# EAGLE design HP25E_1 (EAGLE 9.4.0)
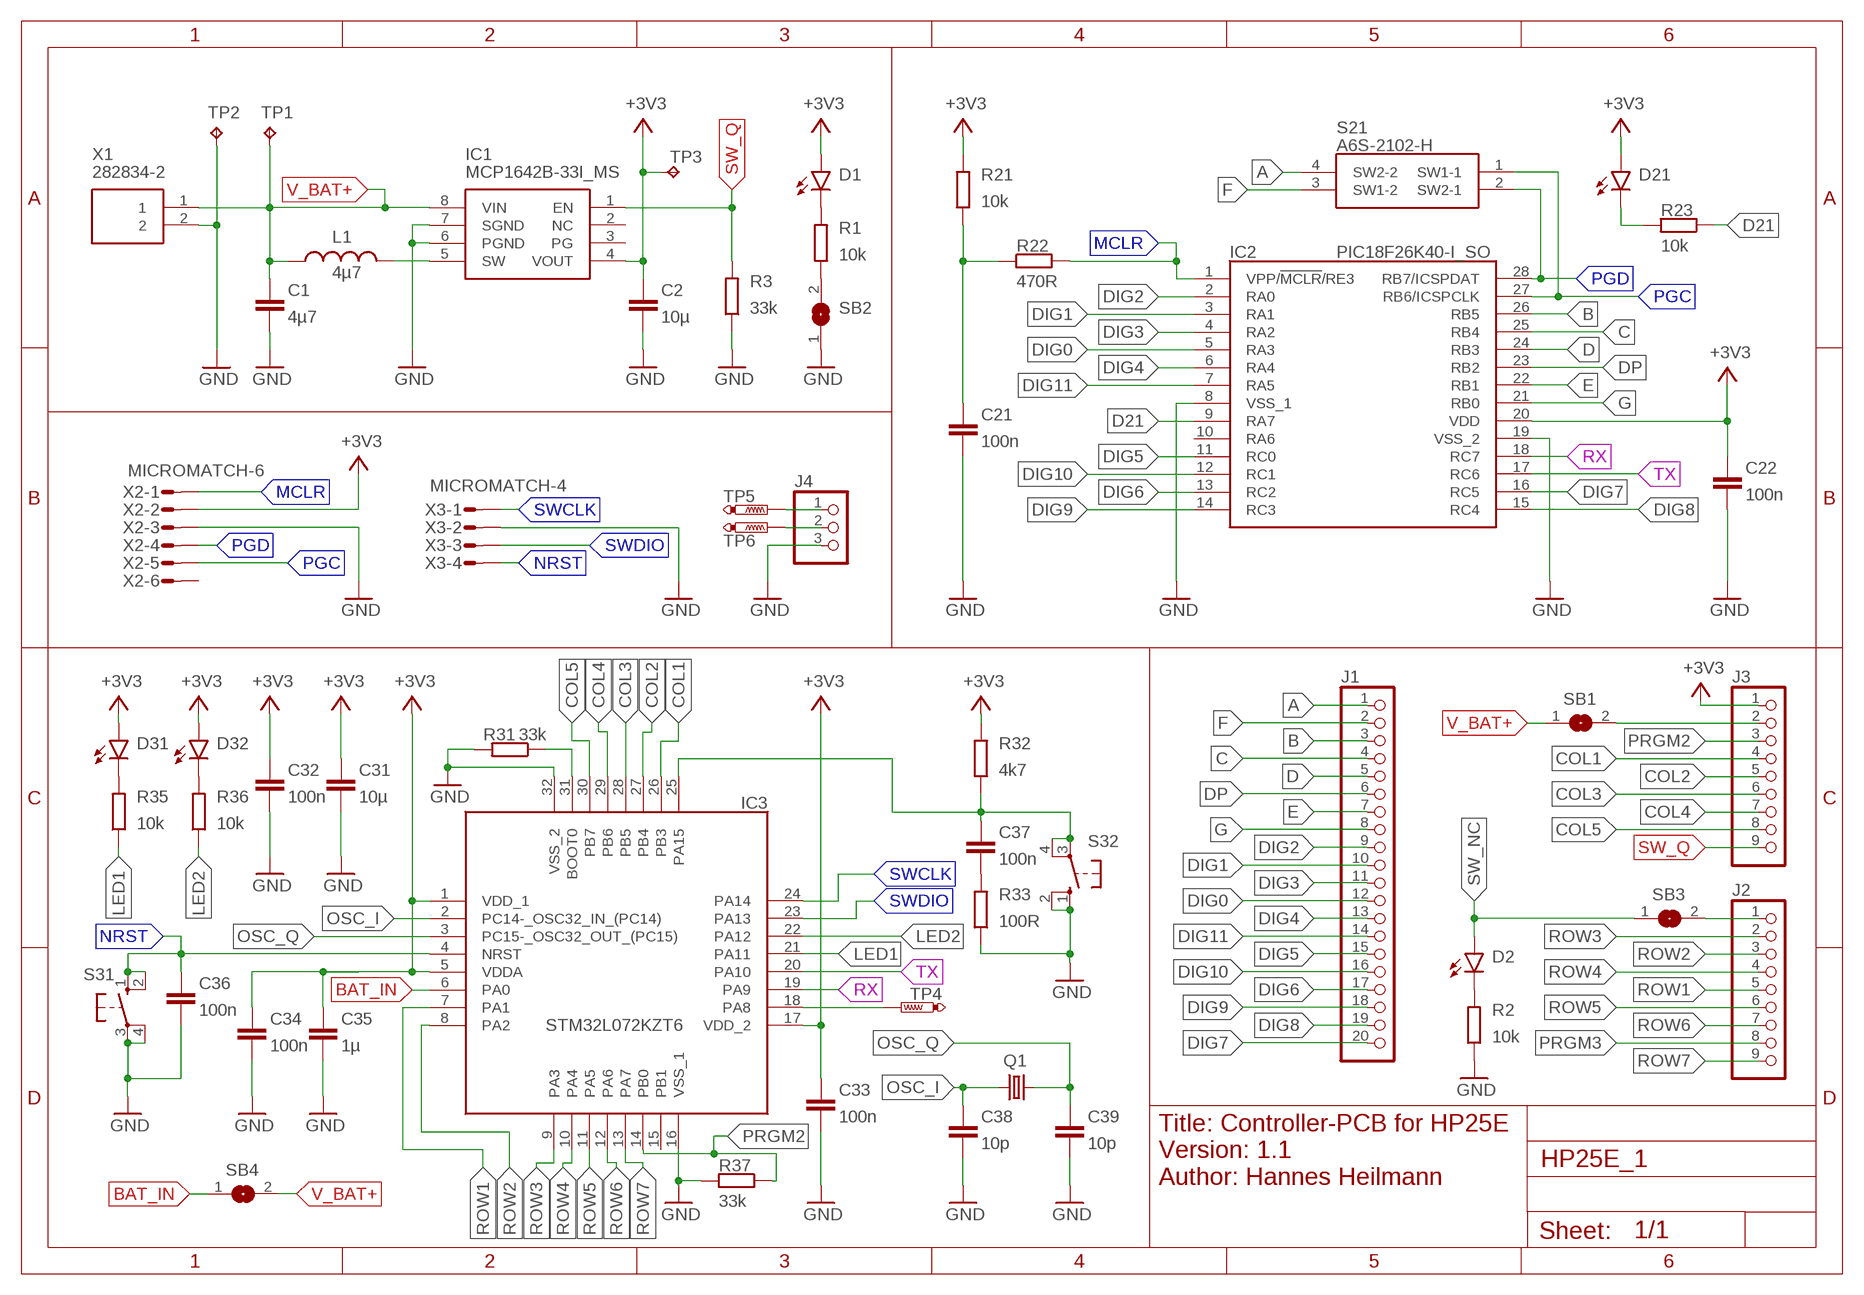
[diagram p0: schematic, sheet 1]

## Parts
C1  4µ7  C-EUC1206K  [C1206K]
C2  10µ  C-EUC1206K  [C1206K]
C21  100n  C-EUC0805K  [C0805K]
C22  100n  C-EUC0805K  [C0805K]
C31  10µ  C-EUC1206K  [C1206K]
C32  100n  C-EUC0805K  [C0805K]
C33  100n  C-EUC0805K  [C0805K]
C34  100n  C-EUC0805K  [C0805K]
C35  1µ  C-EUC1206K  [C1206K]
C36  100n  C-EUC0805K  [C0805K]
C37  100n  C-EUC0805K  [C0805K]
C38  10p  C-EUC0805K  [C0805K]
C39  10p  C-EUC0805K  [C0805K]
D1  LEDSML0805  [SML0805]
D2  LEDSML0805  [SML0805]
D21  LEDSML0805  [SML0805]
D31  LEDSML0805  [SML0805]
D32  LEDSML0805  [SML0805]
IC1  MCP1642B-33I_MS  [SOP65P490X110-8N]
IC2  PIC18F26K40-I_SO  [SOIC127P1030X265-28N]
IC3  STM32L072KZT6  [QFP80P900X900X160-32N]
J1  PINHD-1X20-BIG  [1X20-BIG]
J2  PINHD-1X9  [1X09-BIG]
J3  PINHD-1X9  [1X09-BIG]
J4  PINHD-1X3  [1X03]
L1  4µ7  L-USL4532P  [L4532P]
Q1  CRYSTALMM20SS  [MM20SS]
R1  10k  R-EU_R0805  [R0805]
R2  10k  R-EU_R0805  [R0805]
R3  33k  R-EU_R0805  [R0805]
R21  10k  R-EU_R0805  [R0805]
R22  470R  R-EU_R0805  [R0805]
R23  10k  R-EU_R0805  [R0805]
R31  33k  R-EU_R0805  [R0805]
R32  4k7  R-EU_R0805  [R0805]
R33  100R  R-EU_R0805  [R0805]
R35  10k  R-EU_R0805  [R0805]
R36  10k  R-EU_R0805  [R0805]
R37  33k  R-EU_R0805  [R0805]
S21  A6S-2102-H  [SOP254P980X450-4N]
S31  10-XX  [B3F-10XX]
S32  10-XX  [B3F-10XX]
SB1  SJ  [SJ]
SB2  SJ  [SJ]
SB3  SJ  [SJ]
SB4  SJ  [SJ]
TP1  TPB1,27  [B1,27]
TP2  TPB1,27  [B1,27]
TP3  TPB1,27  [B1,27]
TP4  PTR1B1,27  [B1,27]
TP5  PTR1PAD1-13  [P1-13]
TP6  PTR1PAD1-13  [P1-13]
X1  282834-2  [SHDR2W85P0X254_1X2_554X650X103]
X2  MICROMATCH-6  [MICROMATCH-6]
X3  MICROMATCH-4  [MICROMATCH-4]

## Nets
+3V3: C2.1 C22.1 C31.1 C32.1 C33.1 C34.1 C35.1 D1.A D21.A D31.A D32.A IC1.4(VOUT) IC2.20(VDD) IC3.1(VDD_1) IC3.5(VDDA) IC3.17(VDD_2) J3.1 R21.2 R32.2 TP3.TP X2.2
A: J1.1 S21.4(SW2-2)
B: IC2.26(RB5) J1.3
BAT_IN: IC3.6(PA0) SB4.1
C: IC2.25(RB4) J1.4
COL1: IC3.26(PB3) J3.4
COL2: IC3.27(PB4) J3.5
COL3: IC3.28(PB5) J3.6
COL4: IC3.29(PB6) J3.7
COL5: IC3.30(PB7) J3.8
D: IC2.24(RB3) J1.5
D21: IC2.9(RA7) R23.1
DIG0: IC2.5(RA3) J1.12
DIG1: IC2.3(RA1) J1.10
DIG2: IC2.2(RA0) J1.9
DIG3: IC2.4(RA2) J1.11
DIG4: IC2.6(RA4) J1.13
DIG5: IC2.11(RC0) J1.15
DIG6: IC2.13(RC2) J1.17
DIG7: IC2.16(RC5) J1.20
DIG8: IC2.15(RC4) J1.19
DIG9: IC2.14(RC3) J1.18
DIG10: IC2.12(RC1) J1.16
DIG11: IC2.7(RA5) J1.14
DP: IC2.23(RB2) J1.6
E: IC2.22(RB1) J1.7
F: J1.2 S21.3(SW1-2)
G: IC2.21(RB0) J1.8
GND: C1.2 C2.2 C21.2 C22.2 C31.2 C32.2 C33.2 C34.2 C35.2 C36.2 C38.2 C39.2 IC1.6(PGND) IC1.7(SGND) IC2.8(VSS_1) IC2.19(VSS_2) IC3.16(VSS_1) IC3.32(VSS_2) J4.3 R2.1 R3.1 R31.2 R33.1 R37.2 S31.3(P) S31.4(P1) S32.1(S) S32.2(S1) SB2.1 TP2.TP X1.2 X2.3 X3.2
LED1: IC3.21(PA11) R35.1
LED2: IC3.22(PA12) R36.1
MCLR: IC2.1(VPP/!MCLR!/RE3) R22.2 X2.1
N$1: IC1.5(SW) L1.1
N$2: D21.C R23.2
N$4: C21.1 R21.1 R22.1
N$5: D1.C R1.2
N$6: D2.C R2.2
N$7: C37.1 IC3.25(PA15) R32.1 S32.3(P) S32.4(P1)
N$8: C37.2 R33.2
N$9: J2.1 SB3.2
N$10: IC3.31(BOOT0) R31.1
N$11: R1.1 SB2.2
N$12: D32.C R36.2
N$14: D31.C R35.2
N$15: J4.2 TP6.TP
N$16: J4.1 TP5.TP
N$17: IC3.18(PA8) TP4.TP
NRST: C36.1 IC3.4(NRST) S31.1(S) S31.2(S1) X3.4
OSC_I: C38.1 IC3.2(PC14-_OSC32_IN_(PC14)) Q1.1
OSC_Q: C39.1 IC3.3(PC15-_OSC32_OUT_(PC15)) Q1.4
PGC: IC2.27(RB6/ICSPCLK) S21.1(SW1-1) X2.5
PGD: IC2.28(RB7/ICSPDAT) S21.2(SW2-1) X2.4
PRGM2: IC3.14(PB0) J3.3 R37.1
PRGM3: J2.8
ROW1: IC3.7(PA1) J2.5
ROW2: IC3.8(PA2) J2.3
ROW3: IC3.9(PA3) J2.2
ROW4: IC3.10(PA4) J2.4
ROW5: IC3.11(PA5) J2.6
ROW6: IC3.12(PA6) J2.7
ROW7: IC3.13(PA7) J2.9
RX: IC2.18(RC7) IC3.19(PA9)
SW_I: J3.2 SB1.2
SW_NC: D2.A SB3.1
SW_Q: IC1.1(EN) J3.9 R3.2
SWCLK: IC3.24(PA14) X3.1
SWDIO: IC3.23(PA13) X3.3
TX: IC2.17(RC6) IC3.20(PA10)
V_BAT+: C1.1 IC1.8(VIN) L1.2 SB1.1 SB4.2 TP1.TP X1.1
Unconnected: IC1.2(NC) IC1.3(PG) IC2.10(RA6) IC3.15(PB1) X2.6

## Notes on the sheet
- Title: Controller-PCB for HP25E
  Version: 1.1
  Author: Hannes Heilmann

## Library data of the parts
C1 C2 C21 C22 C31-C39 = rcl:C-EU: CAPACITOR, European symbol; SPICEPREFIX: C
D1 D2 D21 D31 D32 = led:LED: LED OSRAM: - CHIPLED LG R971, LG N971, LY N971, LG Q971, LY Q971, LO R971, LY R971 LH N974, LH R974 LS Q976, LO Q976, LY Q976 LO Q996 - Hyper CHIPLED LW Q18S LB Q993, LB Q99A, LB R99A - SideLED LS A670, LO A670, LY A670, LG A670, LP A670 LB A673, LV A673, LT A673, LW A673 LH A674 LY A675 LS A676, LA A676, LO A676, LY A676, LW A676 LS A679, LY A679, LG A679 - Hyper Micro SIDELED® LS Y876, LA Y876, LO Y876, LY Y876 LT Y87S - SmartLED LW L88C, LW L88S LB L89C, LB L89S, LG L890 LS L89K, LO L89K, LY L89K LS L896, LA L896, LO L896, LY L896 - TOPLED LS T670, LO T670, LY T670, LG T670, LP T670 LSG T670, LSP T670, LSY T670, LOP T670, LYG T670 LG T671, LOG T671, LSG T671 LB T673, LV T673, LT T673, LW T673 LH T674 LS T676, LA T676, LO T676, LY T676, LB T676, LH T676, LSB T676, LW T676 LB T67C, LV T67C, LT T67C, LS T67K, LO T67K, LY T67K, LW E67C LS E67B, LA E67B, LO E67B, LY E67B, LB E67C, LV E67C, LT E67C LW T67C LS T679, LY T679, LG T679 LS T770, LO T770, LY T770, LG T770, LP T770 LB T773, LV T773, LT T773, LW T773 LH T774 LS E675, LA E675, LY E675, LS T675 LS T776, LA T776, LO T776, LY T776, LB T776 LHGB T686 LT T68C, LB T68C - Hyper Mini TOPLED® LB M676 - Mini TOPLED Santana® LG M470 LS M47K, LO M47K, LY M47K Source: http://www.osram.convergy.de LUXEON: - LUMILED® LXK2-PW12-R00, LXK2-PW12-S00, LXK2-PW14-U00, LXK2-PW14-V00 LXK2-PM12-R00, LXK2-PM12-S00, LXK2-PM14-U00 LXK2-PE12-Q00, LXK2-PE12-R00, LXK2-PE12-S00, LXK2-PE14-T00, LXK2-PE14-U00 LXK2-PB12-K00, LXK2-PB12-L00, LXK2-PB12-M00, LXK2-PB14-N00, LXK2-PB14-P00, LXK2-PB14-Q00 LXK2-PR12-L00, LXK2-PR12-M00, LXK2-PR14-Q00, LXK2-PR14-R00 LXK2-PD12-Q00, LXK2-PD12-R00, LXK2-PD12-S00 LXK2-PH12-R00, LXK2-PH12-S00 LXK2-PL12-P00, LXK2-PL12-Q00, LXK2-PL12-R00 Source: www.luxeon.com KINGBRIGHT: KA-3528ASYC Source: www.kingbright.com
IC1 = SamacSys_Parts:MCP1642B-33I_MS: Conv DC-DC 0.5V to 5.5V Synchronous Step Up Single-Out 3.3V 0.3A 8-Pin MSOP Tube Source: Datasheet <https://ww1.microchip.com/downloads/en/DeviceDoc/20005253A.pdf>; ARROW_PART_NUMBER: MCP1642B-33I/MS; ARROW_PRICE-STOCK: https://www.arrow.com/en/products/mcp1642b-33ims/microchip-technology?region=nac; DESCRIPTION: Conv DC-DC 0.5V to 5.5V Synchronous Step Up Single-Out 3.3V 0.3A 8-Pin MSOP Tube; HEIGHT: 1.1mm; MANUFACTURER_NAME: Microchip; MANUFACTURER_PART_NUMBER: MCP1642B-33I/MS; MOUSER_PART_NUMBER: 579-MCP1642B-33I/MS; MOUSER_PRICE-STOCK: https://www.mouser.co.uk/ProductDetail/Microchip-Technology/MCP1642B-33I-MS?qs=kUzwwg2uGjUwNcbFIRVB%252Bw%3D%3D
IC2 = SamacSys_Parts:PIC18F26K40-I_SO: 8-bit Microcontrollers - MCU 64KB Flash, 4KB RAM, 256B EEPROM, 10-bit ADC2, 5-bit DAC, Comp, PWM, CCP, CWG, HLT, WWDT, SCAN/CRC, ZCD, PPS, EUSART, SPI/I2C, IDLE/DOZE/PMD Source: Datasheet <https://componentsearchengine.com/Datasheets/1/PIC18F26K40-I_SO.pdf>; DESCRIPTION: 8-bit Microcontrollers - MCU 64KB Flash, 4KB RAM, 256B EEPROM, 10-bit ADC2, 5-bit DAC, Comp, PWM, CCP, CWG, HLT, WWDT, SCAN/CRC, ZCD, PPS, EUSART, SPI/I2C, IDLE/DOZE/PMD; HEIGHT: 2.65mm; MANUFACTURER_NAME: Microchip; MANUFACTURER_PART_NUMBER: PIC18F26K40-I/SO; MOUSER_PART_NUMBER: 579-PIC18F26K40-I/SO; MOUSER_PRICE-STOCK: https://www.mouser.com/Search/Refine.aspx?Keyword=579-PIC18F26K40-I%2FSO; RS_PART_NUMBER: 1772185; RS_PRICE-STOCK: http://uk.rs-online.com/web/p/products/1772185
IC3 = SamacSys_Parts:STM32L072KZT6: ARM Microcontrollers - MCU Ultra-low-power ARM Cortex-M0+ MCU with 192-Kbytes Flash, 32 MHz CPU, USB Source: Datasheet <https://www.arrow.com/en/products/stm32l072kzt6/stmicroelectronics>; ARROW_PART_NUMBER: STM32L072KZT6; ARROW_PRICE-STOCK: https://www.arrow.com/en/products/stm32l072kzt6/stmicroelectronics?region=nac; DESCRIPTION: ARM Microcontrollers - MCU Ultra-low-power ARM Cortex-M0+ MCU with 192-Kbytes Flash, 32 MHz CPU, USB; HEIGHT: 1.6mm; MANUFACTURER_NAME: STMicroelectronics; MANUFACTURER_PART_NUMBER: STM32L072KZT6; MOUSER_PART_NUMBER: 511-STM32L072KZT6; MOUSER_PRICE-STOCK: https://www.mouser.co.uk/ProductDetail/STMicroelectronics/STM32L072KZT6?qs=mwoc%252BQmZlGJ4eN3sEity4A%3D%3D
J1 = adafruit:PINHD-1X20: PIN HEADER
J2 J3 = adafruit:PINHD-1X9: Pin header 1x10 0.1" spacing With round pins
J4 = pinhead:PINHD-1X3: PIN HEADER
L1 = rcl:L-US: INDUCTOR, American symbol; SPICEPREFIX: L
Q1 = crystal:CRYSTAL: CRYSTAL; OC_FARNELL: unknown; OC_NEWARK: unknown
R1-R3 R21-R23 R31-R33 R35-R37 = rcl:R-EU_: RESISTOR, European symbol; SPICEPREFIX: R
S21 = SamacSys_Parts:A6S-2102-H: 2 Way Surface Mount DIP Switch DP Source: Datasheet <http://docs-emea.rs-online.com/webdocs/0b76/0900766b80b76b3d.pdf>; DESCRIPTION: 2 Way Surface Mount DIP Switch DP; HEIGHT: 4.5mm; MANUFACTURER_NAME: Omron Electronics; MANUFACTURER_PART_NUMBER: A6S-2102-H; MOUSER_PART_NUMBER: 653-A6S-2102-H; MOUSER_PRICE-STOCK: https://www.mouser.com/Search/Refine.aspx?Keyword=653-A6S-2102-H; RS_PART_NUMBER: 0534768; RS_PRICE-STOCK: http://uk.rs-online.com/web/p/products/0534768
S31 S32 = switch-omron:10-XX: OMRON SWITCH; MPN: B3F-1000; OC_FARNELL: 176432; OC_NEWARK: 36M3542
SB1-SB4 = jumper:SJ: SMD solder JUMPER
TP1-TP3 = testpad:TP: Test pad
TP4-TP6 = testpad:PTR1: TEST PIN
X1 = SamacSys_Parts:282834-2: TE CONNECTIVITY / BUCHANAN - 282834-2 - TERMINAL BLOCK, WIRE TO BRD, 2POS, 16AWG Source: Datasheet <https://www.te.com/commerce/DocumentDelivery/DDEController?Action=srchrtrv&DocNm=282834&DocType=Customer Drawing&DocLang=English&DocFormat=pdf&PartCntxt=282834-2>; ALLIED_NUMBER: 70086732; ALLIED_PRICE-STOCK: https://www.alliedelec.com/te-connectivity-282834-2/70086732/; DESCRIPTION: TE CONNECTIVITY / BUCHANAN - 282834-2 - TERMINAL BLOCK, WIRE TO BRD, 2POS, 16AWG; HEIGHT: 10.3mm; MANUFACTURER_NAME: TE CONNECTIVITY / BUCHANAN; MANUFACTURER_PART_NUMBER: 282834-2
X2 = con-amp-micromatch:MICROMATCH-6: MicroMaTch 6 7-215464-6 / 0-215464-6 Drawing Number C-215464 DDEController.pdf; MPN: 7-215464-6; OC_FARNELL: 3784630; OC_NEWARK: 19R8125
X3 = con-amp-micromatch:MICROMATCH-4: MicroMaTch 4 7-215464-4 / 0-215464-4 Drawing Number C-215464 DDEController.pdf; MPN: 7-215464-4; OC_FARNELL: 3784629; OC_NEWARK: 19R8124

## Board
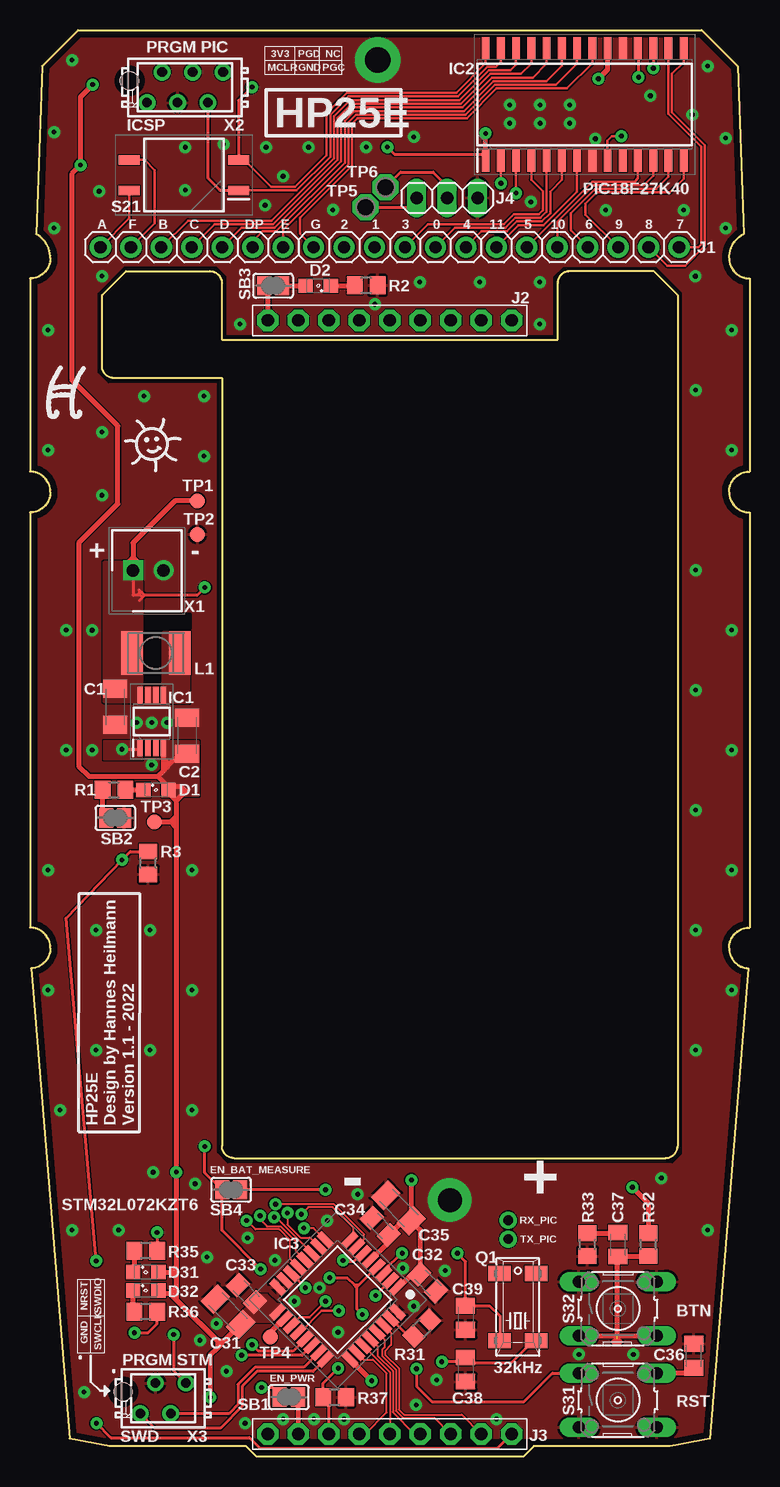
[diagram p1: board, top side]
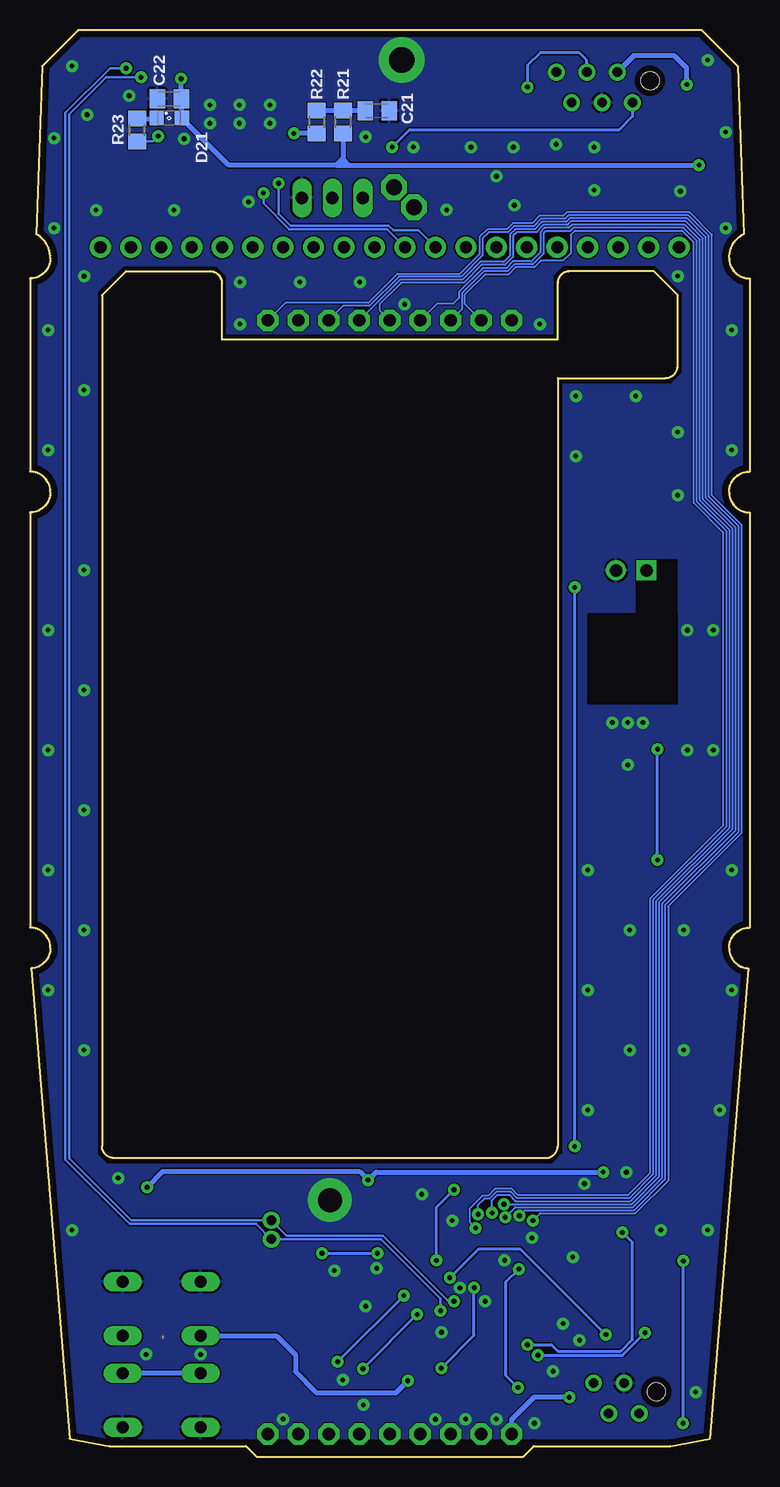
[diagram p2: board, bottom side, seen from below]

Size 60 x 118.88 mm. Coordinates in mm from the lower left corner, seen from the top.
Outline: 1,115.88 4,118.88 56,118.88 59,115.88 59.5,101.88 arc62 58.3,99.88 arc90 60,98.17 60,82.08 arc90 58.3,80.38 arc90 60,78.67 60,44.08 arc90 58.3,42.38 arc87 59.9,40.67 56.7,1.5 53.38,0.88 42,0.88 41.12,0 18.88,0 18,0.88 6.62,0.88 3.3,1.5 0.1,40.67 arc87 1.7,42.38 arc90 0,44.08 0,78.67 arc90 1.7,80.38 arc90 0,82.08 0,98.17 arc90 1.7,99.88 arc62 0.5,101.88 1,115.88
Copper layers (1*16): Top 0.035mm / dielectric 1.5mm / Bottom 0.035mm
Design rules "FVM_default *": minimum track width 0.1mm, minimum drill 0.4mm, track to track 0.1mm, track to pad 0.1mm, pad to pad 0.1mm, via to via 0.1mm, smd to smd 0.1mm, copper to edge 0.5mm, drill to drill 0.2mm, minimum pad ring 0.3mm, minimum via ring 0.3mm, stop-mask expansion 0.075mm, vias tented up to drill 0mil, thermal gap 0.2mm
tRestrict: area 5.7,24.5 to 54.3,99.1; area 9.7,64.3 to 13.4,70.2; area 21.5,4.1 to 21.7,5.8; area 20.1,96.7 to 20.4,98.5; area 16.6,21.3 to 16.9,23.1; area 7,52.3 to 7.2,54.1
bRestrict: area 5.7,24.5 to 54.3,99.1; area 6.1,62.8 to 13.4,70.2; area 6.1,70.3 to 9.4,74.7
Milling: 17 lines

### Footprints (pad centres in the part's own frame; a part is rotated, then mirrored left to right if it is on the bottom)
C1206K = smd 1.5 x 2: 1 -1.5,0; 2 1.5,0
C0805K = smd 1.3 x 1.6: 1 -1,0; 2 1,0
SML0805 = smd 1.2 x 1.2: A 1.05,0; C -1.05,0
SOP65P490X110-8N = smd 1.4 x 0.45: 1 -2.2,0.975; 2 -2.2,0.325; 3 -2.2,-0.325; 4 -2.2,-0.975; 5 2.2,-0.975; 6 2.2,-0.325; 7 2.2,0.325; 8 2.2,0.975
SOIC127P1030X265-28N = smd 1.85 x 0.65: 1 -4.675,8.255; 2 -4.675,6.985; 3 -4.675,5.715; 4 -4.675,4.445; 5 -4.675,3.175; 6 -4.675,1.905; 7 -4.675,0.635; 8 -4.675,-0.635; 9 -4.675,-1.905; 10 -4.675,-3.175; 11 -4.675,-4.445; 12 -4.675,-5.715; 13 -4.675,-6.985; 14 -4.675,-8.255; 15 4.675,-8.255; 16 4.675,-6.985; 17 4.675,-5.715; 18 4.675,-4.445; 19 4.675,-3.175; 20 4.675,-1.905; 21 4.675,-0.635; 22 4.675,0.635; 23 4.675,1.905; 24 4.675,3.175; 25 4.675,4.445; 26 4.675,5.715; 27 4.675,6.985; 28 4.675,8.255
QFP80P900X900X160-32N = smd 1.475 x 0.6: 1 -4.238,2.8; 2 -4.238,2; 3 -4.238,1.2; 4 -4.238,0.4; 5 -4.238,-0.4; 6 -4.238,-1.2; 7 -4.238,-2; 8 -4.238,-2.8; 17 4.238,-2.8; 18 4.238,-2; 19 4.238,-1.2; 20 4.238,-0.4; 21 4.238,0.4; 22 4.238,1.2; 23 4.238,2; 24 4.238,2.8 | smd 0.6 x 1.475: 9 -2.8,-4.238; 10 -2,-4.238; 11 -1.2,-4.238; 12 -0.4,-4.238; 13 0.4,-4.238; 14 1.2,-4.238; 15 2,-4.238; 16 2.8,-4.238; 25 2.8,4.238; 26 2,4.238; 27 1.2,4.238; 28 0.4,4.238; 29 -0.4,4.238; 30 -1.2,4.238; 31 -2,4.238; 32 -2.8,4.238
1X20-BIG = drill 1.016 pad 1.778: 1 -24.13,0; 2 -21.59,0; 3 -19.05,0; 4 -16.51,0; 5 -13.97,0; 6 -11.43,0; 7 -8.89,0; 8 -6.35,0; 9 -3.81,0; 10 -1.27,0; 11 1.27,0; 12 3.81,0; 13 6.35,0; 14 8.89,0; 15 11.43,0; 16 13.97,0; 17 16.51,0; 18 19.05,0; 19 21.59,0; 20 24.13,0
1X09-BIG = drill 1.016 pad 1.778 octagon: 1 -10.16,0; 2 -7.62,0; 3 -5.08,0; 4 -2.54,0; 5 0,0; 6 2.54,0; 7 5.08,0; 8 7.62,0; 9 10.16,0
1X03 = drill 1.016 long: 1 -2.54,0; 2 0,0; 3 2.54,0
L4532P = smd 1.8 x 3.6: 1 -2,0; 2 2,0
MM20SS = smd 1.27 x 1.88: 1 -2.794,-1.524; 2 2.794,-1.524; 3 2.794,1.524; 4 -2.794,1.524
R0805 = smd 1.3 x 1.5: 1 -0.95,0; 2 0.95,0
SOP254P980X450-4N = smd 1.75 x 0.8: 1 -4.55,1.27; 2 -4.55,-1.27; 3 4.55,-1.27; 4 4.55,1.27
B3F-10XX = drill 1.016 long: 1 -3.251,2.261; 2 3.251,2.261; 3 -3.251,-2.261; 4 3.251,-2.261
SJ = smd 1.168 x 1.6: 1 -0.762,0; 2 0.762,0
B1,27 = smd 1.27 x 1.27: TP 0,0
P1-13 = drill 1.321 pad 2.159 octagon: TP 0,0
SHDR2W85P0X254_1X2_554X650X103 = drill 1.05 pad 1.575 square: 1 0,0 | drill 1.05 pad 1.575: 2 2.54,0
MICROMATCH-6 = drill 0.813: 1 3.175,1.27; 2 1.905,-1.27; 3 0.635,1.27; 4 -0.635,-1.27; 5 -1.905,1.27; 6 -3.175,-1.27 | hole 1.5: 4.63,-0.55
MICROMATCH-4 = drill 0.8: 1 1.905,1.27; 2 0.635,-1.27; 3 -0.635,1.27; 4 -1.905,-1.27 | hole 1.5: 3.34,-0.55

### Placement (x,y rotation side)
C1  7.09,62.46 270 top
C2  13.11,60.07 90 top
C21  31.04,112.14 0 bottom
C22  48.39,113.13 180 bottom
C31  16.51,12.07 135 top
C32  33.17,14.48 315 top
C33  18.03,13.59 135 top
C34  29.21,19.18 135 top
C35  30.73,20.7 135 top
C36  55.35,8.4 90 top
C37  49.02,17.66 90 top
C38  36.32,7.24 270 top
C39  36.32,11.56 270 top
D1  10.52,55.55 0 top
D2  24.03,97.56 180 top
D21  48.39,111.53 0 bottom
D31  9.65,15.37 0 top
D32  9.65,13.85 0 top
IC1  10.16,61.24 90 top
IC2  46.25,112.68 90 top
IC3  25.65,13.08 225 top
J1  30,100.78 0 top
J2  30,94.67 0 top
J3  30,1.88 0 top
J4  34.79,104.88 0 top
L1  10.52,66.96 180 top
Q1  40.69,12.45 90 top
R1  7.01,55.55 0 top
R2  28.04,97.59 180 top
R3  9.86,49.46 90 top
R21  33.91,111.2 270 bottom
R22  36.09,111.2 270 bottom
R23  51.05,110.54 90 bottom
R31  32.66,10.7 45 top
R32  51.56,17.66 90 top
R33  46.48,17.66 90 top
R35  9.65,17.15 180 top
R36  9.65,12.07 180 top
R37  25.4,4.96 0 top
S21  12.83,106.78 180 top
S31  49.02,4.69 0 top
S32  49.02,12.31 0 top
SB1  21.59,4.96 0 top
SB2  7.11,53.22 180 top
SB3  20.27,97.56 180 top
SB4  16.76,22.23 180 top
TP1  13.97,79.63 0 top
TP2  13.97,76.84 0 top
TP3  10.39,52.88 0 top
TP4  20.04,9.96 0 top
TP5  27.99,104.12 0 top
TP6  29.64,105.77 0 top
X1  8.59,73.85 0 top
X2  12.93,114.1 180 top
X3  11.1,4.85 180 top

### Tracks (layer width: path | path; a pad name or v marks a point on that pad's centre or on a via)
+3V3  (via drill 0.4)
  Top 0.254: C31.1 18.03,11.47 18.03,11.48
  Top 0.406: IC2.20 48.16,115.57 v47.4,114.81 | C2.1 12.55,58.57 11.44,57.47 | 11.13,57.15 11.44,57.47 | 10.64,56.67 11.13,57.15 | 10.64,56.67 4.93,56.67 4.08,57.52 4.08,76.14 7.32,79.38 7.32,85.88 3.48,89.72 3.48,106.89 v4.22,107.62 4.22,113.31 v5.23,114.33 | 11.13,57.15 11.13,57.79 | 11.13,58.14 11.13,59.03 IC1.4 | 11.44,57.47 11.13,57.79 | 11.13,57.79 11.13,58.14 | 11.44,57.47 11.44,57.83 11.13,58.14 | 10.64,56.67 11.48,55.83 | 11.48,55.83 11.62,55.69 11.62,55.27 12.21,54.69 | 12.21,54.69 12.22,54.69 12.98,55.45 12.6,55.83 11.48,55.83 | 12.21,54.69 12.21,53.32 | 12.21,53.32 12.21,52.45 | 12.21,52.45 v12.21,23.7 12.21,15.83 | 12.21,15.83 12.21,14.91 | 12.21,14.91 12.21,14.12 | 12.21,14.12 12.21,13.07 | IC3.5 29.92,17.91 C34.1 31.09,19.64 C35.1 | IC3.1 30.76,14.1 31.84,15.19 C32.1 32.56,15.29 32.56,18.87 C35.1 | 15.65,9.08 15.03,8.47 v15.03,4.94 v15.04,4.93 | 15.65,9.08 15.92,9.36 | 15.92,9.36 16.19,9.63 | 16.19,9.63 C31.1 | 15.92,9.36 15.65,9.63 | 12.57,12.7 15.65,9.63 | 12.57,12.7 | 12.21,13.07 11.99,13.29 | 11.99,13.29 11.67,13.6 | 15.65,9.63 16.19,9.63 | 15.65,9.63 15.65,9.08 | 12.57,12.7 12.21,13.07 | 11.75,15.37 12.21,14.91 | 11.75,15.37 12.21,15.83 | 11.67,13.6 11.85,13.78 | 11.85,13.78 12.19,14.12 12.21,14.12 | 11.99,13.29 11.99,13.64 11.85,13.78 | C35.1 v31.8,23.03 v31.8,23.04 | v50.24,22.43 51.56,21.11 R32.2 | D31.A 11.75,15.37 | D32.A 10.94,13.6 11.67,13.6 | TP3.TP 11.77,52.88 | 12.21,52.45 11.77,52.88 | 12.21,53.32 11.77,52.88
  Bottom 0.406: R21.2 33.91,108.18 | 33.91,108.18 34.2,107.89 | 34.2,107.89 34.47,107.62 | 34.47,107.62 33.43,107.62 | 33.43,107.62 v4.22,107.62 | 33.43,107.62 33.69,107.89 | 33.69,107.89 33.91,108.1 33.91,108.18 | 33.69,107.89 34.2,107.89 | v5.23,114.33 5.23,115.7 6.27,116.74 9.65,116.74 X2.2 | J3.1 19.84,3.07 17.98,4.93 v15.04,4.93 | v12.21,23.7 31.14,23.7 v31.8,23.04 31.83,23.04 32.54,23.75 48.92,23.75 v50.24,22.43 | 34.47,107.62 43.42,107.62 D21.A 47.34,113.08 C22.1 47.39,114.8 v47.4,114.81
  pour Top (no thermals): 11.05,59.62 14.02,59.62 14.02,55.04 11.05,55.04
  pour Top (no thermals): 17.4,11.76 19.18,13.54 19.74,13.54 20.55,12.73 20.95,12.73 20.95,12.04 20.12,11.2 18.49,11.2 17.96,11.2
A
  Top 0.203: S21.4 8.28,103.17 J1.1
B
  Top 0.203: IC2.26 40.54,115.98 40.08,115.52 38.28,115.52 35.8,113.03 26.69,113.03 25.35,111.69 25.35,108.18 20.16,102.99 13.17,102.99 J1.3
BAT_IN  (via drill 0.4)
  Top 0.254: IC3.6 27.68,16.93 26.98,16.23 26.21,16.23 v26.11,16.33 | v24.64,22.23 SB4.1
  Bottom 0.254: v26.11,16.33 26.11,20.75 v24.64,22.23
C
  Top 0.203: IC2.25 41.81,116.08 40.95,115.22 38.41,115.22 35.92,112.73 26.82,112.73 25.65,111.56 25.65,108.06 20.28,102.69 15.41,102.69 J1.4
COL1
  Top 0.152: IC3.26 27.83,8.08 28.6,8.08 29.75,6.93 29.75,3.68 27.94,1.88 J3.4
COL2
  Top 0.152: IC3.27 30,7.04 J3.5
COL3
  Top 0.152: IC3.28 28.98,9.19 28.98,8.41 30.25,7.14 30.25,3.71 32.08,1.88 J3.6
COL4
  Top 0.152: J3.7 33.73,3.23 31.09,3.23 30.5,3.81 30.5,7.25 29.36,8.39 29.36,8.89 29.57,9.1 29.57,9.74 IC3.29
COL5
  Top 0.152: IC3.30 30.12,10.31 30.12,9.3 29.61,8.79 29.61,8.5 30.76,7.35 30.76,3.92 31.19,3.48 36.02,3.48 J3.8
D
  Top 0.203: IC2.24 43.08,116.06 41.94,114.92 38.54,114.92 36.05,112.43 26.94,112.43 25.95,111.44 25.95,107.93 20.41,102.39 17.64,102.39 J1.5
D21  (via drill 0.4)
  Top 0.203: IC2.9 48.16,109.65 48.54,110.03 v49.3,110.03
  Bottom 0.203: v49.3,110.03 49.74,109.59 R23.1
DIG0
  Top 0.203: J1.12 35.42,102.39 39.65,102.39 40.48,103.22 42.57,103.22 43.08,103.73 IC2.5
DIG1  (via drill 0.4)
  Top 0.203: v40.54,105.28 IC2.3
  Bottom 0.203: J1.10 30.22,102.26 38.38,102.26 40.54,104.42 v40.54,105.28
DIG2  (via drill 0.4)
  Top 0.203: v39.27,106.1 IC2.2
  Bottom 0.203: J1.9 27.59,102.18 29.7,102.18 30.09,102.57 38.25,102.57 39.27,103.58 v39.27,106.1
DIG3
  Top 0.203: J1.11 33.19,102.69 39.52,102.69 40.36,103.53 42.45,103.53 42.77,103.86 42.77,105.44 41.81,106.4 IC2.4
DIG4
  Top 0.203: J1.13 37.66,102.08 39.77,102.08 40.61,102.92 42.7,102.92 43.38,103.61 43.38,105.41 44.35,106.38 IC2.6
DIG5
  Top 0.203: J1.15 46.9,106.25 50.42,106.25 50.7,106.53 IC2.11
DIG6
  Top 0.203: J1.17 45.11,102.17 45.11,103.59 47.16,105.64 52.25,105.64 53.24,106.63 IC2.13
DIG7
  Top 0.203: J1.20 55.73,100.78 55.98,101.03 55.98,109.15 53.24,111.89 IC2.16
DIG8
  Top 0.203: J1.19 53.12,99.24 54.63,99.24 56.28,100.89 56.28,109.27 53.54,112.02 53.54,115.22 54.51,116.18 IC2.15
DIG9
  Top 0.203: J1.18 46.33,103.5 46.33,104.38 47.28,105.34 53.36,105.34 54.51,106.48 IC2.14
DIG10
  Top 0.203: J1.16 43.97,102.88 47.03,105.94 51.18,105.94 51.97,106.73 IC2.12
DIG11
  Top 0.203: J1.14 40.73,102.62 42.82,102.62 45.62,105.41 45.62,106.4 | IC2.7 45.62,106.4 | 45.62,106.4
DP
  Top 0.203: IC2.23 44.35,115.9 43.06,114.61 38.66,114.61 36.17,112.12 27.07,112.12 26.26,111.31 26.26,107.81 20.53,102.08 19.38,102.08 18.57,101.27 J1.6
E
  Top 0.203: IC2.22 45.62,116.08 43.85,114.31 38.79,114.31 36.3,111.82 27.19,111.82 26.56,111.19 26.56,107.68 21.11,102.23 J1.7
F
  Top 0.203: J1.2 10.41,102.78 10.41,107.19 9.55,108.05 S21.3
G
  Top 0.203: IC2.21 46.89,116.11 44.79,114 38.91,114 36.43,111.52 27.32,111.52 26.86,111.06 26.86,107.56 22.53,103.22 22.53,101.89 J1.8
GND  (via drill 0.4, 2, 2.1)
  other vias: 28.75,96.01 37.5,97.88 19.61,104.27 19.68,109.09 25.25,103.88 40,112.63 47.14,109.82 56.5,115.88 3.5,116.38 41.78,104.55 48,103.88 55.47,98.35 6,98.38 5.76,105.44 2,102.38 55.22,111.81 34.62,15.5 31.09,15.7 24.79,19.66 20.42,16.36 18.14,18.21 14.75,16.62 15.54,11.08 14.17,9.68 16.38,7.11 17.93,2.77 21.12,3.12 23.67,3.12 26.2,3.1 25.68,10.37 22.05,12.93 24.16,14.05 13.77,22.73 27.33,21.85 32,12.53 32.21,4.29 33.91,6.38 50.32,8.5 45.77,8.5 38.9,3.12 10.28,23.7 7.39,18.87 4.5,5.38 10,33.88 10,43.88 5.5,33.88 5.5,43.88 13.5,38.88 13.5,28.88 2.5,28.88 3.5,18.88 1.5,38.88 58.5,38.88 55.5,33.88 13.5,48.88 55.5,43.88 55.5,53.88 55.5,63.88 58.5,58.88 58.5,48.88 1.5,48.88 3.02,58.88 3.02,68.88 1.5,83.88 6,80.1 6,85.38 14.5,88.38 9.5,88.38 14.5,83.38 52.65,23.21 56.5,18.88 58.5,68.88 55.5,73.88 58.5,83.88 1.5,93.88 58.5,93.88 55.5,88.88 2,110.38 58,102.38 58,109.88 17.5,94.38 42.5,94.38 42.5,97.88 32.5,97.88 54.5,103.88 45,112.63 12.95,105.54 16.13,109.35 10.14,57.63 5.18,58.88 5.18,68.86 8.89,61.16 10.16,61.16 11.43,61.16 35,21.38 29,116.38 21.1,106.68 12.95,109.09 23.24,109.09 32,109.96 28.04,109.12 42.54,112.63 40,111.11 42.54,111.11 45,111.11 51.74,113.4
  pour Top (rank 2): 60,98.38 60,81.88 58.5,80.38 60,78.88 60,43.88 58.5,42.38 60,40.88 57.12,1.53 2.88,1.53 0,40.88 1.5,42.38 0,43.88 0,78.88 1.5,80.38 0,81.88 0,98.38 1.5,99.88 1.5,100.38 0.5,101.88 0.5,115.38 4,118.88 56,118.88 59.5,115.38 59.5,101.88 58.5,99.88
  pour Bottom: 60,98.38 60,81.88 58.5,80.38 60,78.88 60,43.88 58.5,42.38 60,40.88 57.12,1.53 2.88,1.53 0,40.88 1.5,42.38 0,43.88 0,78.88 1.5,80.38 0,81.88 0,98.38 1.5,99.88 1.5,100.38 0.5,101.88 0.5,115.38 4,118.88 56,118.88 59.5,115.38 59.5,101.88 58.5,99.88
  pour Top (rank 2, no thermals): 5.69,57.66 14.73,57.66 14.73,68.91 14.73,75.29 5.84,75.29 5.41,75.29 5.41,74.37 5.41,57.66
  pour Top (no thermals): 46.33,109.43 46.33,106.73 47.45,106.73 47.45,109.43
  pour Top (no thermals): 48.84,118.24 50.01,118.24 50.01,116.11 48.84,116.11
LED1  (via drill 0.4)
  Top 0.254: IC3.21 21.93,8.79 19.05,8.79 v18.52,9.32 | v10.59,18.67 10.6,18.66 R35.1
  Bottom 0.254: v18.52,9.32 16.51,9.32 15.97,8.79 10.74,8.79 9.76,9.77 9.76,17.84 v10.59,18.67
LED2  (via drill 0.4)
  Top 0.254: IC3.22 22.7,8.44 v17.65,8.44 | v8.71,10.31 9.86,10.31 10.6,11.06 R36.1
  Bottom 0.254: v17.65,8.44 10.59,8.44 v8.71,10.31
MCLR  (via drill 0.4)
  Top 0.254: v29.79,109.12 30.4,108.51 37.87,108.51 38,108.38 IC2.1
  Top 0.406: IC2.1 v38,110.25
  Bottom 0.254: X2.1 9.75,111.69 10.87,110.57 28.35,110.57 v29.79,109.12
  Bottom 0.406: R22.2 v38,110.25
N$1
  pour Top (no thermals): 11.05,62.87 13.28,62.87 13.28,68.63 11.05,68.63
N$2
  Bottom 0.406: R23.2 49.48,111.49 D21.C
N$4
  Bottom 0.406: R22.1 R21.1 C21.1
N$5
  Top 0.406: R1.2 D1.C
N$6
  Top 0.406: D2.C 27.07,97.56 R2.2
N$7  (via drill 0.4)  (1 unrouted)
  Top 0.406: IC3.25 28.48,6.3 v28.5,6.3 | S32.3 48.95,10.05 | 48.95,9.55 48.67,9.55 48.95,9.83 | 48.95,9.55 49.23,9.55 48.95,9.83 | 48.95,10.05 S32.4 | 48.95,9.55 48.95,9.83 | 48.95,10.05 48.95,16.58 C37.1 49.07,16.7 R32.1
  Bottom 0.406: v28.5,6.3 29.49,5.31 36.09,5.31 37.87,7.09 37.87,8.49 39.44,10.05 S32.3
N$8
  Top 0.406: R33.2 48.97,18.61 C37.2
N$9
  Top 0.406: J2.1 19.84,97.23 SB3.2
N$10
  Top 0.254: IC3.31 31.54,10.02 R31.1
N$11
  Top 0.406: SB2.2 6.06,53.51 R1.1
N$12
  Top 0.406: R36.2 8.6,12.17 D32.C
N$14
  Top 0.406: R35.2 8.7,15.47 D31.C
N$15
  Top 0.254: TP6.TP 30.91,107.04 33.6,107.04 34.79,105.85 J4.2
N$16
  Top 0.254: TP5.TP 31.8,104.12 32.25,104.56 J4.1
N$17
  Top 0.406: TP4.TP 20.04,10.3 IC3.18
NRST  (via drill 0.4)
  Top 0.254: IC3.4 27.43,14.29 | 27.43,14.29 27.24,14.1 | v27.71,11.84 v27.7,11.84 27.24,12.3 27.24,14.1 | v32.23,7.32 32.23,5.84 33.5,4.57 41.21,4.57 43.58,6.95 S31.1 | v24.99,14.89 26.45,14.89 27.04,14.29 | X3.4 11.99,7.14 v11.99,10.16 | 27.04,14.29 27.24,14.1 | 27.04,14.29 27.43,14.29
  Top 0.406: C36.1 54.9,6.95 S31.2
  Bottom 0.254: v11.99,10.16 19.13,17.3 22.58,17.3 v24.99,14.89 | v27.71,11.84 v32.23,7.32
  Bottom 0.406: S31.1 S31.2
OSC_I  (via drill 0.4)
  Top 0.254: 36.69,7.88 C38.1 | IC3.2 28.83,13.43 v28.83,13.41 | C38.1 35.98,7.9 v34.34,7.9 | C38.1 36.74,7.83 40.13,7.83 41.96,9.65 Q1.1
  Bottom 0.254: v28.83,13.41 v34.34,7.9
OSC_Q  (via drill 0.4)
  Top 0.254: IC3.3 29.5,15.46 30.98,16.94 v31.04,16.94 | C39.1 36.47,12.7 | C39.1 36.32,16.25 v35.64,16.93 | C39.1 38.32,12.56 39.17,11.71 Q1.4
  Bottom 0.254: v35.64,16.93 31.05,16.93 v31.04,16.94
PGC
  Top 0.203: S21.1 22.25,105.51 25.04,108.31 25.04,111.81 26.57,113.34 35.67,113.34 38.16,115.82 38.86,115.82 39.27,116.23 IC2.27
  Top 0.254: S21.1 15.85,105.51 14.83,106.53 X2.5
PGD  (via drill 0.4)
  Top 0.203: S21.2 17.86,108.05 20.09,105.82 22.12,105.82 24.74,108.44 24.74,111.94 26.44,113.64 35.55,113.64 38,116.09 IC2.28
  Top 0.254: v18.52,114.12 17.38,112.98 S21.2
  Bottom 0.254: v18.52,114.12 18.52,115.93 17.45,116.99 14.2,116.99 13.56,116.36 X2.4
PRGM2  (via drill 0.4)
  Top 0.152: 24.92,4.49 R37.1 | IC3.14
  Top 0.254: J3.3 24.92,4.49 | R37.1 24.45,6.09 v25.7,7.34 | v22.96,14.07 IC3.14
  Bottom 0.254: v25.7,7.34 22.96,10.09 v22.96,14.07
ROW1  (via drill 0.4)
  Top 0.152: IC3.7 27.86,18.12 27.86,18.52 25.35,21.03 v20.47,21.03
  Bottom 0.152: J2.5 30.84,95.51 30.84,96.01 29.03,97.82 23.82,97.82 22.35,99.29 20.39,99.29 19.71,99.97 19.71,100.18 19.71,101.73 19.41,102.03 17.78,102.03 17.19,102.63 15.18,102.63 14.89,102.92 5.3,102.92 3.89,101.51 3.89,79.78 1.41,77.3 1.41,52.31 7.55,46.17 7.55,23.31 9.83,21.03 v20.47,21.03
ROW2  (via drill 0.4)
  Top 0.152: IC3.8 26.98,18.36 26.98,19.05 25.25,20.78 23.22,20.78 v22.63,20.2
  Bottom 0.152: v22.63,20.2 22.63,20.98 22.12,21.49 21.67,21.49 21.11,22.05 19.91,22.05 19.4,21.54 10.04,21.54 8.05,23.52 8.05,46.38 1.91,52.52 1.91,77.09 4.4,79.58 4.4,101.3 5.51,102.41 14.68,102.41 14.97,102.12 16.98,102.12 17.17,101.93 17.17,100.24 18.06,99.35 19.62,99.35 20.18,98.79 22.14,98.79 23.98,96.95 23.98,95.62 J2.3
ROW3  (via drill 0.4)
  Top 0.152: IC3.9 23.66,19.04 v22.84,19.04
  Bottom 0.152: J2.2 23.72,96.01 23.72,96.84 22.03,98.53 20.08,98.53 19.52,99.1 17.96,99.1 17.41,99.65 15.54,99.65 14.91,100.28 14.91,101.81 14.55,102.16 5.61,102.16 4.65,101.2 4.65,79.47 2.17,76.99 2.17,52.62 8.31,46.48 8.31,23.62 10.14,21.79 19.3,21.79 19.81,22.3 21.21,22.3 21.77,21.74 22.25,21.74 23.34,20.65 23.34,19.54 v22.84,19.04
ROW4  (via drill 0.4)
  Top 0.152: IC3.10 23.33,18.23 22.56,18.23 21.46,19.33 v21.46,20.3
  Bottom 0.152: J2.4 26.08,96.06 24.72,96.06 24.23,96.55 24.23,97.06 22.24,99.04 20.29,99.04 19.73,99.6 18.17,99.6 17.42,100.34 17.42,102.03 17.08,102.38 15.08,102.38 14.79,102.67 5.4,102.67 4.14,101.41 4.14,79.68 1.66,77.2 1.66,52.41 7.8,46.27 7.8,23.41 9.93,21.29 19.51,21.29 20.02,21.8 21.01,21.8 21.46,21.34 v21.46,20.3
ROW5  (via drill 0.4)
  Top 0.152: IC3.11 20.5,19.93 v20.37,19.93
  Bottom 0.152: J2.6 29.14,98.07 23.93,98.07 22.45,99.55 20.5,99.55 19.96,100.08 19.96,101.86 19.53,102.29 17.89,102.29 17.29,102.88 15.29,102.88 15,103.17 5.2,103.17 3.64,101.61 3.64,79.89 1.16,77.41 1.16,52.19 7.3,46.05 7.3,23.21 9.72,20.78 19.52,20.78 v20.37,19.93
ROW6  (via drill 0.4)
  Top 0.152: IC3.12 22.2,17.1 22.2,17.88 20.9,19.18 19.76,19.18 19.18,19.76 v19.18,20.07
  Bottom 0.152: J2.7 33.88,95.88 31.69,95.88 29.25,98.32 24.03,98.32 22.25,100.1 22.25,101.53 21.74,102.03 20.14,102.03 19.64,102.54 17.99,102.54 17.4,103.13 15.39,103.13 15.1,103.42 5.09,103.42 3.38,101.72 3.38,79.99 0.91,77.51 0.91,52.08 7.04,45.94 7.04,23.1 9.62,20.53 18.72,20.53 v19.18,20.07
ROW7  (via drill 0.4)
  Top 0.152: IC3.13 21.69,16.48 21.69,18.03 20.79,18.93 18.79,18.93 v18.06,19.66
  Bottom 0.152: J2.9 38.69,96.14 31.79,96.14 29.35,98.58 24.14,98.58 22.5,100.21 22.5,101.63 21.85,102.29 20.25,102.29 19.74,102.79 18.1,102.79 17.5,103.39 15.52,103.39 15.23,103.67 4.99,103.67 3.13,101.82 3.13,80.1 0.65,77.62 0.65,51.98 6.79,45.84 6.79,23 9.51,20.28 17.45,20.28 v18.06,19.66
RX  (via drill 0.4, 0.8)
  Top 0.152: IC2.18 50.75,117.3
  Top 0.203: v24.64,12.93 v24.63,12.93 23.31,11.61 22.48,11.61 IC3.19
  Top 0.254: 50.75,117.3 v50.75,114.94
  Bottom 0.203: v50.75,114.94 53.65,114.94 56.74,111.84 56.74,24.87 51.56,19.69 v39.88,19.69 v39.88,19.68 38.61,18.41 30.58,18.41 25.2,13.03 24.74,13.03 v24.64,12.93
SW_I
  Top 0.406: J3.2 22.38,4.93 SB1.2
SW_NC
  Top 0.406: SB3.1 D2.A
SW_Q  (via drill 0.4)
  Top 0.254: J3.9 38.99,0.7 19.18,0.7 18.3,1.58 6.74,1.58 v5.54,2.77 | v7.67,58.93 9.07,58.93 IC1.1 | v5.53,16.3 3,44.88 v7.67,49.71 8.37,50.41 R3.2
  Bottom 0.254: v5.53,16.3 5.54,16.29 v5.54,2.77 | v7.67,49.71 v7.67,58.93
  pour Top (no thermals): 9.27,59.62 9.27,58.09 6.22,58.09 6.22,59.36 6.22,59.62
SWCLK
  Top 0.254: IC3.24 23.62,7.09 18.92,7.09 17.7,5.87 17.7,4.19 15.88,2.36 10.41,2.36 X3.1
SWDIO
  Top 0.254: IC3.23 22.84,7.44 18.78,7.44 17.35,6.02 17.35,4.34 16.59,3.58 X3.3
TX  (via drill 0.4, 0.8)
  Top 0.203: IC3.20 22.55,10.37 24.33,12.14 v25.76,12.14
  Top 0.254: IC2.17 v51.97,115.7
  Bottom 0.203: v51.97,115.7 53.32,115.7 57.05,111.97 57.05,24.74 51.69,19.38 41.15,19.38 v39.88,18.11 30.71,18.11 25.76,13.16 v25.76,12.14
V_BAT+  (via drill 0.4)
  Top 0.254: SB1.1 20.83,5.13 20.22,5.74 v19.3,5.74 | v19.23,15.62 16,18.85 SB4.2 14.58,23.65 v14.58,25.83 | X1.1 8.59,71.8 8.64,71.76 9.25,71.76 9.09,71.91 9.09,72.21 9.55,71.76 | v14.58,72.42 13.92,71.76 9.55,71.76 | 9.14,71.35 9.55,71.76
  Top 0.406: TP1.TP 12.09,79.63 8.59,76.13 8.59,74.88 | 8.59,74.37 X1.1 8.75,73.85 9.2,74.3 8.61,74.88 8.59,74.88 | 8.59,74.37 8.59,74.88 | 8.59,74.37 8.08,74.37 8.59,74.88
  Bottom 0.254: v19.3,5.74 20.3,6.73 20.3,14.56 v19.23,15.62 | v14.58,25.83 v14.58,72.42
  pour Top (no thermals): 9.3,62.87 6.2,62.87 6.2,74.55 9.3,74.55

### Text on the board
tPlace: - | +
tNames: PRGM PIC | 3V3 | PGD | NC | MCLR | GND | PGC | ICSP | HP25E | PIC18F27K40 | A | F | B | C | D | DP | E | G | 2 | 1 | 3 | 0 | 4 | 11 | 5 | 10 | 6 | 9 | 8 | 7 | + | - | HP25E / Design by Hannes Heilmann / Version 1.1 - 2022 | EN_BAT_MEASURE | STM32L072KZT6 | RX_PIC | TX_PIC | NRST | SWDIO | BTN | GND | SWCLK | PRGM STM | 32kHz | EN_PWR | RST | SWD